# Altium schematic sheet MainSheet.SchDoc
size A3
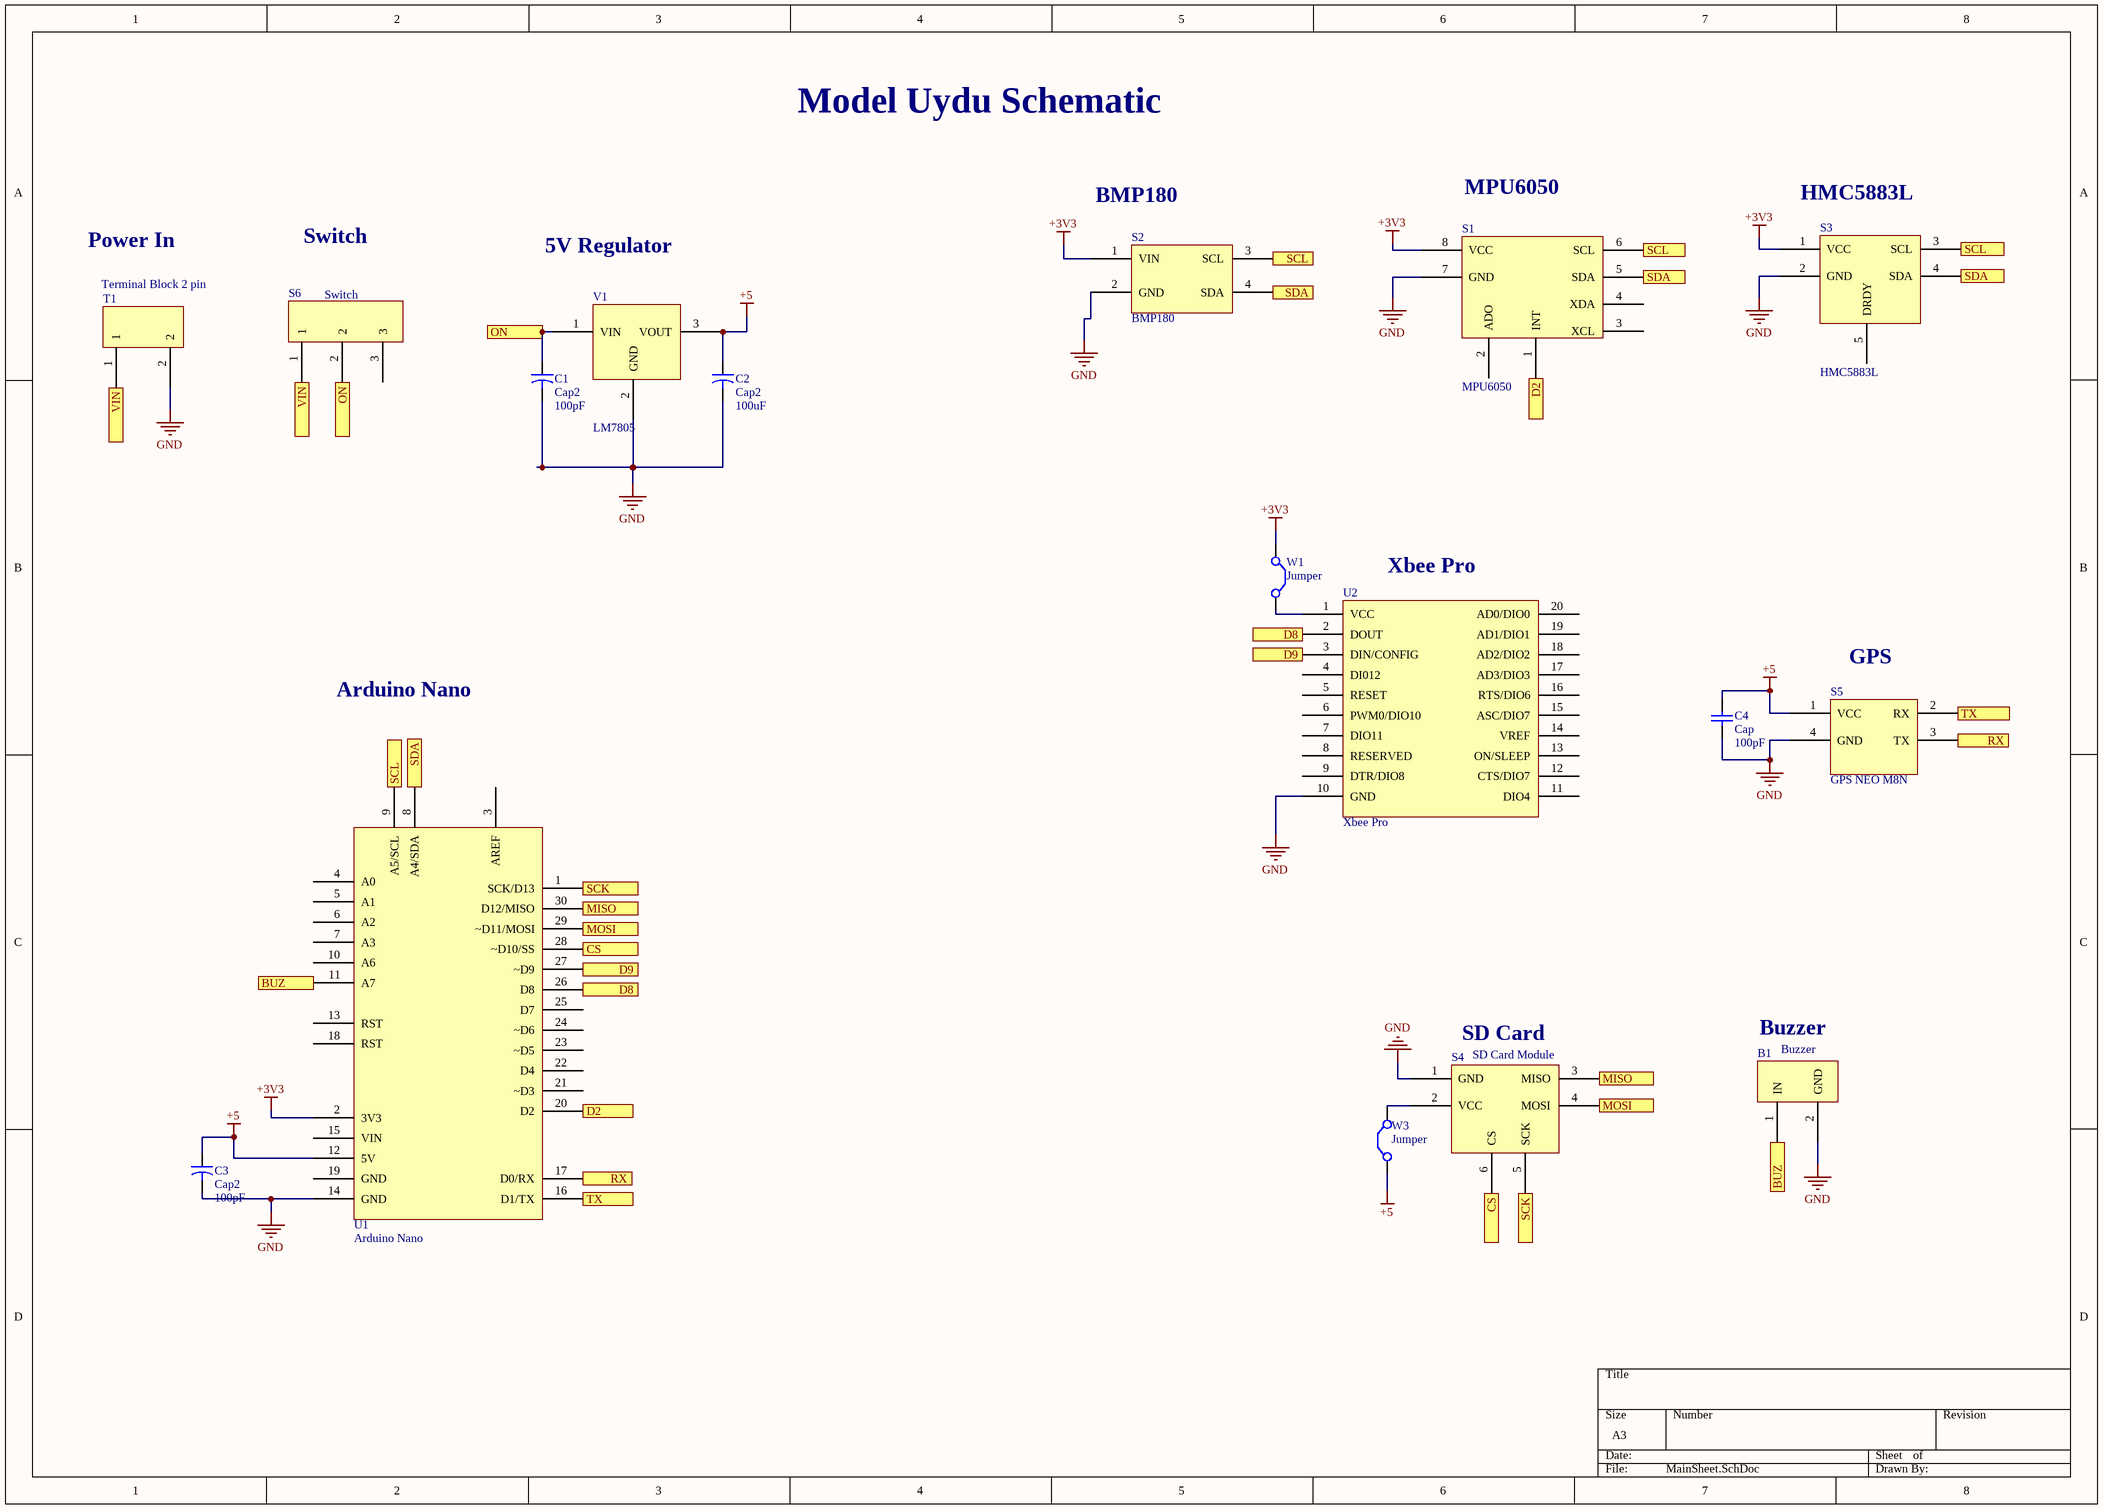
[diagram p0: MainSheet.SchDoc]

## Parts
B1  Buzzer  [BUZZER]
C1  Cap2  value 100pF  [CAPR5-4X5]
C2  Cap2  value 100uF  [CAPR5-4X5]
C3  Cap2  value 100pF  [CAPR5-4X5]
C4  Cap  value 100pF  [RAD-0.2]
S1  MPU6050  [MPU6050]
S2  BMP180  [BMP180]
S3  HMC5883L  [HMC5883L]
S4  SD Card Module  [SD Card Module]
S5  GPS NEO M8N  [GPS NEO M8N]
S6  Switch  [Switch]
T1  Terminal Block 2 pin  [Terminal Block 2 pin]
U1  Arduino Nano  [ARDUINO NANO v3]
U2  Xbee Pro  [Xbee]
V1  LM7805  [LM7805 Voltage Regulator]
W1  Jumper  [RAD-0.2]
W3  Jumper  [RAD-0.2]

## Ports
BUZ, CS, D2, D8, D9, MISO, MOSI, ON, RX, SCK, SCL, SDA, TX, VIN

## Nets
+3V3: S1.8(VCC) S2.1(VIN) S3.1(VCC) U1.2(3V3) W1.1(C1)
+5: C2.1 C3.1 C4.1 S5.1(VCC) U1.12(5V) V1.3(VOUT) W3.1(C1)
GND: B1.2(GND) C1.2 C2.2 C3.2 C4.2 S1.7(GND) S2.2(GND) S3.2(GND) S4.1(GND) S5.4(GND) T1.2 U1.14(GND) U2.10(GND) V1.2(GND)
BUZ: B1.1(IN) U1.11(A7) ; port BUZ
CS: S4.6(CS) U1.28(~D10/SS) ; port CS
D2: S1.1(INT) U1.20(D2) ; port D2
D8: U1.26(D8) U2.2(DOUT) ; port D8
D9: U1.27(~D9) U2.3(DIN/CONFIG) ; port D9
MISO: S4.3(MISO) U1.30(D12/MISO) ; port MISO
MOSI: S4.4(MOSI) U1.29(~D11/MOSI) ; port MOSI
ON: C1.1 S6.2 V1.1(VIN) ; port ON
RX: S5.3(TX) U1.17(D0/RX) ; port RX
SCK: S4.5(SCK) U1.1(SCK/D13) ; port SCK
SCL: S1.6(SCL) S2.3(SCL) S3.3(SCL) U1.9(A5/SCL) ; port SCL
SDA: S1.5(SDA) S2.4(SDA) S3.4(SDA) U1.8(A4/SDA) ; port SDA
TX: S5.2(RX) U1.16(D1/TX) ; port TX
VIN: S6.1 T1.1 ; port VIN
NetS4_2: S4.2(VCC) W3.2(C2)
NetU2_1: U2.1(VCC) W1.2(C2)

Not connected (* = marked no-connect by the designer): S1 2(ADO) 3(XCL) 4(XDA); S3 5(DRDY); S6 3; U1 3(AREF) 4(A0) 5(A1) 6(A2) 7(A3) 10(A6) 13(RST) 15(VIN) 18(RST) 19(GND) 21(~D3) 22(D4) 23(~D5) 24(~D6) 25(D7); U2 4(DI012) 5(RESET) 6(PWM0/DIO10) 7(DIO11) 8(RESERVED) 9(DTR/DIO8) 11(DIO4) 12(CTS/DIO7) 13(ON/SLEEP) 14(VREF) 15(ASC/DIO7) 16(RTS/DIO6) 17(AD3/DIO3) 18(AD2/DIO2) 19(AD1/DIO1) 20(AD0/DIO0)

## Notes on the sheet
- Model Uydu Schematic
- Power In
- Switch
- (near S2) BMP180
- (near S1) MPU6050
- (near S3) HMC5883L
- 5V Regulator
- (near U2) Xbee Pro
- Arduino Nano
- (near S5) GPS
- (near S4) SD Card
- Buzzer

## Library data of the parts
B1 = Buzzer: Buzzer audio
C1-C3 = Cap2: Capacitor; Published: 23-Sep-2002; PackageReference: CAPR5-4X5; Publisher: Altium Limited; PackageDescription: Capacitor; 2 Leads
C4 = Cap: Capacitor; Published: 8-Jun-2000; LatestRevisionDate: 17-Jul-2002; LatestRevisionNote: Re-released for DXP Platform.; PackageReference: RAD-0.3; Publisher: Altium Limited; PackageDescription: Radial Cap, Thru-Hole; 2 Leads; 0.3 in Pin Spacing
S1 = MPU6050: MPU6050 Gyro Sensor PCB
S2 = BMP180: BMP180 Pressure Sensor
S3 = HMC5883L: HMC58883L Digital Compass
S6 = Switch: Slide Switch 4mm pitch
T1 = Terminal Block 2 pin: Terminal Block 2 pin (5mm)
U1 = Arduino Nano: Arduino Nano v3
U2 = Xbee Pro: Xbee Pro 90HP
V1 = LM7805: LM7805 5V Voltage Regulator
W1 W3 = Jumper: Jumper Wire; Published: 24-Mar-1999; LatestRevisionDate: 17-Jul-2002; LatestRevisionNote: Re-released for DXP Platform.; PackageReference: RAD-0.2; Publisher: Altium Limited; PackageDescription: Radial Cap, Thru-Hole; 2 Leads; 0.2 in Pin Spacing